# EAGLE schematic Bee_Hive_Mona_parallel_scara_V0.1 (EAGLE 9.7.0)

## Sheet 1 of 2
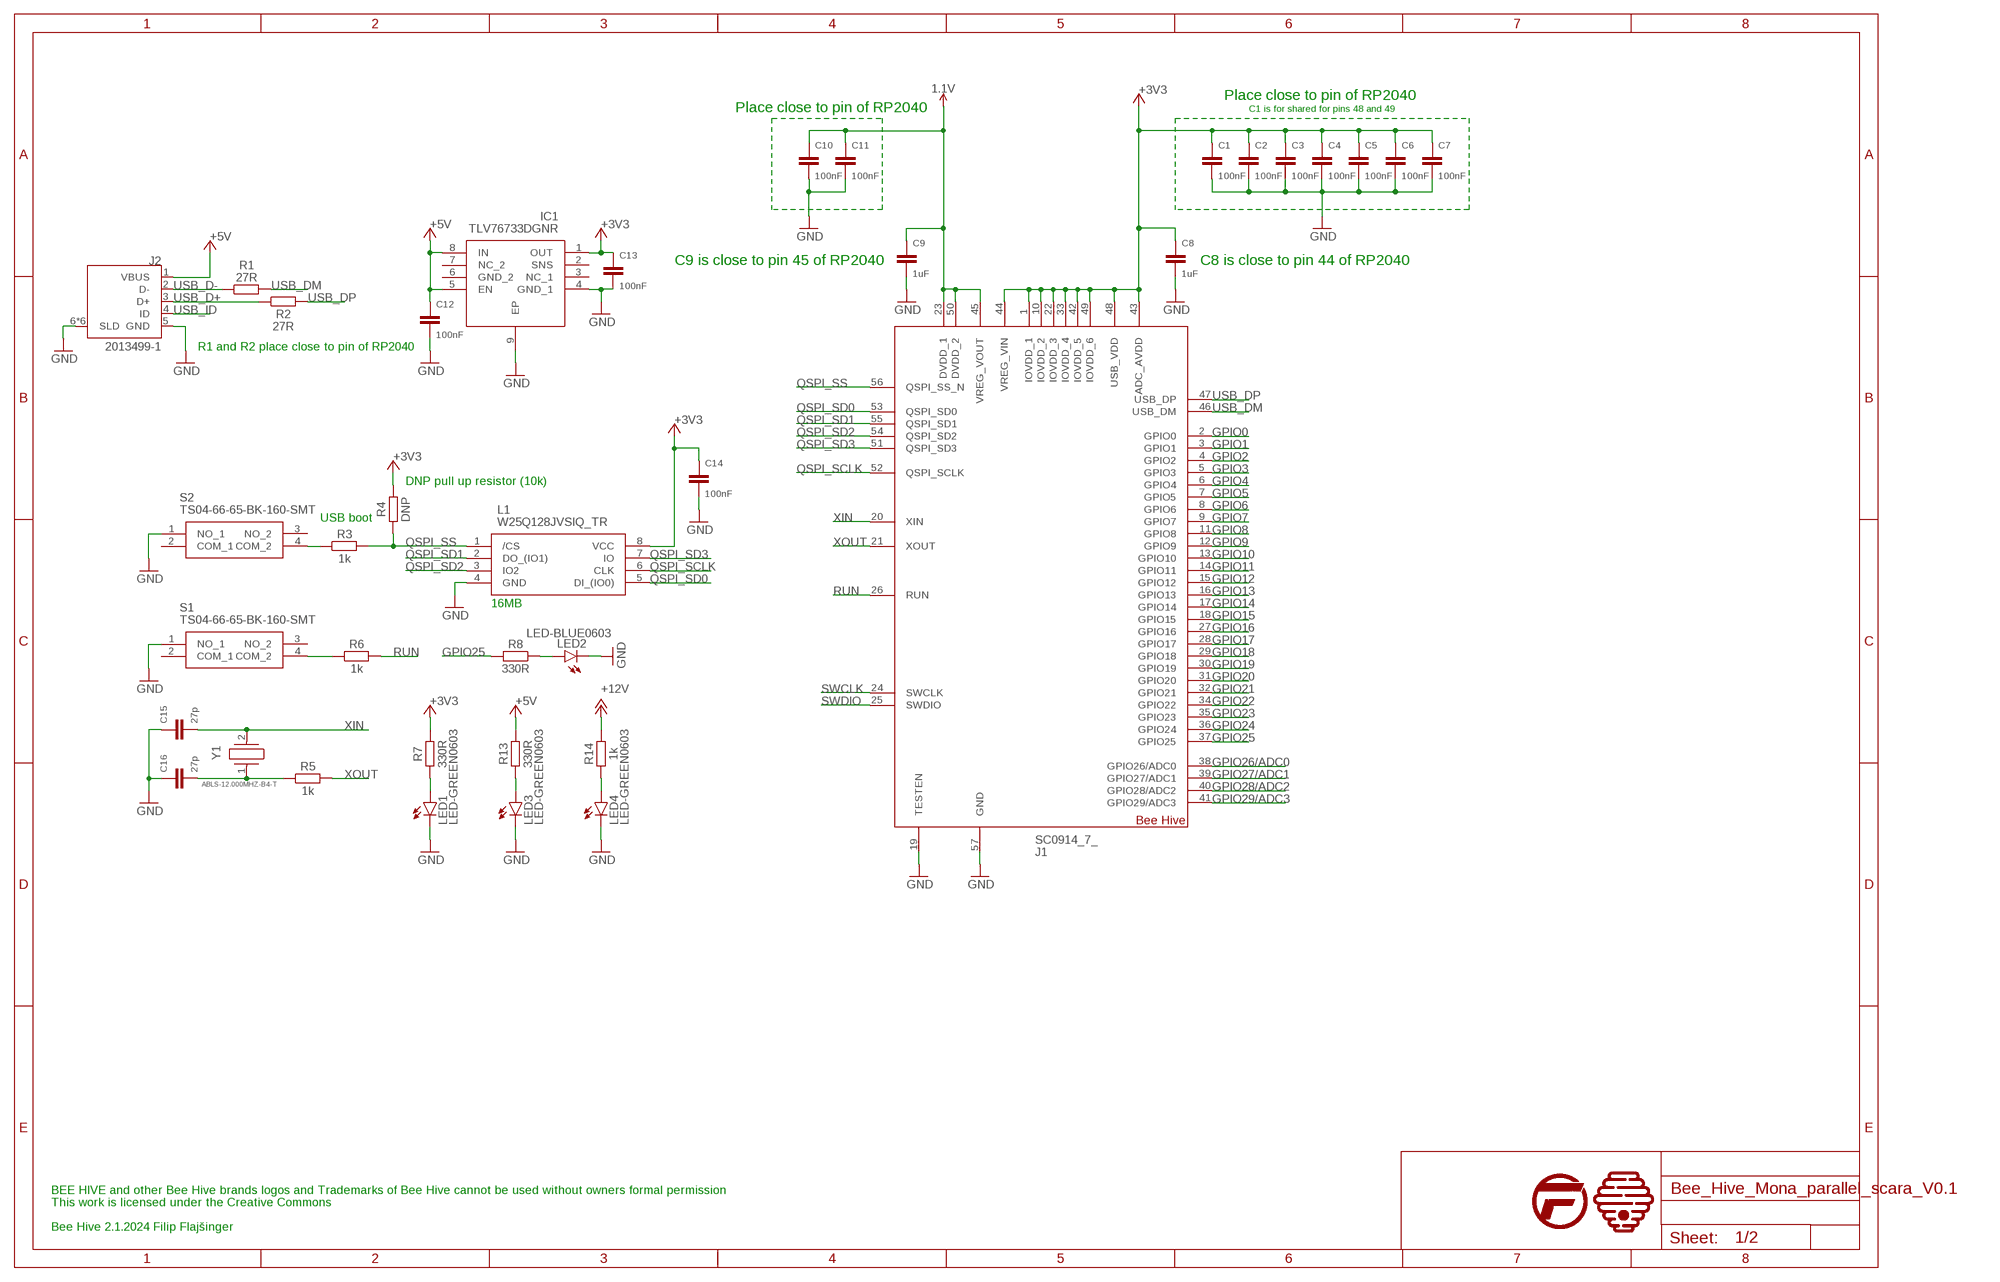
[diagram p0: schematic, sheet 1]

### Parts
C1  100nF  C_CHIP-0603(1608-METRIC)  [CAPC1608X85]
C2  100nF  C_CHIP-0603(1608-METRIC)  [CAPC1608X85]
C3  100nF  C_CHIP-0603(1608-METRIC)  [CAPC1608X85]
C4  100nF  C_CHIP-0603(1608-METRIC)  [CAPC1608X85]
C5  100nF  C_CHIP-0603(1608-METRIC)  [CAPC1608X85]
C6  100nF  C_CHIP-0603(1608-METRIC)  [CAPC1608X85]
C7  100nF  C_CHIP-0603(1608-METRIC)  [CAPC1608X85]
C8  1uF  C_CHIP-0603(1608-METRIC)  [CAPC1608X85]
C9  1uF  C_CHIP-0603(1608-METRIC)  [CAPC1608X85]
C10  100nF  C_CHIP-0603(1608-METRIC)  [CAPC1608X85]
C11  100nF  C_CHIP-0603(1608-METRIC)  [CAPC1608X85]
C12  100nF  C_CHIP-0603(1608-METRIC)  [CAPC1608X85]
C13  100nF  C_CHIP-0603(1608-METRIC)  [CAPC1608X85]
C14  100nF  C_CHIP-0603(1608-METRIC)  [CAPC1608X85]
C15  27p  C_CHIP-0603(1608-METRIC)  [CAPC1608X85]
C16  27p  C_CHIP-0603(1608-METRIC)  [CAPC1608X85]
IC1  TLV76733DGNR  [SOP65P490X110-9N]
J1  SC0914_7_  [QFN40P700X700X90-57N]
J2  2013499-1  [TE_2013499-1]
L1  W25Q128JVSIQ_TR  [SOIC127P780X195-8N]
LED1  LED-GREEN0603  [0603-GREEN]
LED2  LED-BLUE0603  [0603-BLUE]
LED3  LED-GREEN0603  [0603-GREEN]
LED4  LED-GREEN0603  [0603-GREEN]
R1  27R  R_CHIP-0603(1608-METRIC)  [RESC1608X60]
R2  27R  R_CHIP-0603(1608-METRIC)  [RESC1608X60]
R3  1k  R_CHIP-0603(1608-METRIC)  [RESC1608X60]
R4  DNP  R_CHIP-0603(1608-METRIC)  [RESC1608X60]
R5  1k  R_CHIP-0603(1608-METRIC)  [RESC1608X60]
R6  1k  R_CHIP-0603(1608-METRIC)  [RESC1608X60]
R7  330R  R_CHIP-0603(1608-METRIC)  [RESC1608X60]
R8  330R  R_CHIP-0603(1608-METRIC)  [RESC1608X60]
R13  330R  R_CHIP-0603(1608-METRIC)  [RESC1608X60]
R14  1k  R_CHIP-0603(1608-METRIC)  [RESC1608X60]
S1  TS04-66-65-BK-160-SMT  [TS046665BK160SMT]
S2  TS04-66-65-BK-160-SMT  [TS046665BK160SMT]
Y1  ABLS-12.000MHZ-B4-T  [ABLS]

### Nets
1.1V: C9.1 C10.1 C11.1 J1.23(DVDD_1) J1.45(VREG_VOUT) J1.50(DVDD_2)
+3V3: C1.1 C2.1 C3.1 C4.1 C5.1 C6.1 C7.1 C8.1 C13.1 C14.1 IC1.1(OUT) J1.1(IOVDD_1) J1.10(IOVDD_2) J1.22(IOVDD_3) J1.33(IOVDD_4) J1.42(IOVDD_5) J1.43(ADC_AVDD) J1.44(VREG_VIN) J1.48(USB_VDD) J1.49(IOVDD_6) L1.8(VCC) R4.2 R7.2 ; also sheet 2
+5V: C12.1 IC1.5(EN) IC1.8(IN) J2.1(VBUS) R13.2 ; also sheet 2
+12V: R14.2 ; also sheet 2
GND: C1.2 C2.2 C3.2 C4.2 C5.2 C6.2 C7.2 C8.2 C9.2 C10.2 C11.2 C12.2 C13.2 C14.2 C15.1 C16.1 IC1.4(GND_1) IC1.9(EP) J1.19(TESTEN) J1.57(GND) J2.5(GND) J2.6(SLD) J2.7(SLD) J2.8(SLD) J2.9(SLD) J2.10(SLD) J2.11(SLD) L1.4(GND) LED1.C LED2.C LED3.C LED4.C S1.1(NO_1) S2.1(NO_1) ; also sheet 2
GPIO0: J1.2(GPIO0) ; also sheet 2
GPIO1: J1.3(GPIO1) ; also sheet 2
GPIO2: J1.4(GPIO2) ; also sheet 2
GPIO3: J1.5(GPIO3) ; also sheet 2
GPIO4: J1.6(GPIO4) ; also sheet 2
GPIO5: J1.7(GPIO5) ; also sheet 2
GPIO6: J1.8(GPIO6) ; also sheet 2
GPIO7: J1.9(GPIO7) ; also sheet 2
GPIO8: J1.11(GPIO8) ; also sheet 2
GPIO9: J1.12(GPIO9) ; also sheet 2
GPIO10: J1.13(GPIO10) ; also sheet 2
GPIO11: J1.14(GPIO11) ; also sheet 2
GPIO12: J1.15(GPIO12) ; also sheet 2
GPIO13: J1.16(GPIO13) ; also sheet 2
GPIO14: J1.17(GPIO14) ; also sheet 2
GPIO15: J1.18(GPIO15) ; also sheet 2
GPIO16: J1.27(GPIO16) ; also sheet 2
GPIO17: J1.28(GPIO17) ; also sheet 2
GPIO18: J1.29(GPIO18) ; also sheet 2
GPIO19: J1.30(GPIO19) ; also sheet 2
GPIO20: J1.31(GPIO20) ; also sheet 2
GPIO21: J1.32(GPIO21) ; also sheet 2
GPIO22: J1.34(GPIO22) ; also sheet 2
GPIO23: J1.35(GPIO23) ; also sheet 2
GPIO24: J1.36(GPIO24) ; also sheet 2
GPIO25: J1.37(GPIO25) R8.2 ; also sheet 2
GPIO26/ADC0: J1.38(GPIO26/ADC0) ; also sheet 2
GPIO27/ADC1: J1.39(GPIO27/ADC1) ; also sheet 2
GPIO28/ADC2: J1.40(GPIO28/ADC2) ; also sheet 2
GPIO29/ADC3: J1.41(GPIO29/ADC3) ; also sheet 2
N$4: R3.1 S2.4(COM_2)
N$5: R6.1 S1.4(COM_2)
N$6: C16.2 R5.1 Y1.1
N$8: LED2.A R8.1
N$40: LED1.A R7.1
N$48: LED3.A R13.1
N$49: LED4.A R14.1
QSPI_SCLK: J1.52(QSPI_SCLK) L1.6(CLK)
QSPI_SD0: J1.53(QSPI_SD0) L1.5(DI_(IO0))
QSPI_SD1: J1.55(QSPI_SD1) L1.2(DO_(IO1))
QSPI_SD2: J1.54(QSPI_SD2) L1.3(IO2)
QSPI_SD3: J1.51(QSPI_SD3) L1.7(IO)
QSPI_SS: J1.56(QSPI_SS_N) L1.1(/CS) R3.2 R4.1
RUN: J1.26(RUN) R6.2
SWCLK: J1.24(SWCLK)
SWDIO: J1.25(SWDIO)
USB_D+: J2.3(D+) R2.1
USB_D-: J2.2(D-) R1.1
USB_DM: J1.46(USB_DM) R1.2
USB_DP: J1.47(USB_DP) R2.2
USB_ID: J2.4(ID)
XIN: C15.2 J1.20(XIN) Y1.2
XOUT: J1.21(XOUT) R5.2
Unconnected: IC1.2(SNS) IC1.3(NC_1) IC1.6(GND_2) IC1.7(NC_2) S1.2(COM_1) S1.3(NO_2) S2.2(COM_1) S2.3(NO_2)

### Notes on the sheet
- Place close to pin of RP2040
- Place close to pin of RP2040 | C1 is for shared for pins 48 and 49
- C9 is close to pin 45 of RP2040 | C8 is close to pin 44 of RP2040
- R1 and R2 place close to pin of RP2040
- DNP pull up resistor (10k)
- USB boot
- 16MB
- BEE HIVE and other Bee Hive brands logos and Trademarks of Bee Hive cannot be used without owners formal permission
- This work is licensed under the Creative Commons
- Bee Hive 2.1.2024 Filip Flajšinger

## Sheet 2 of 2
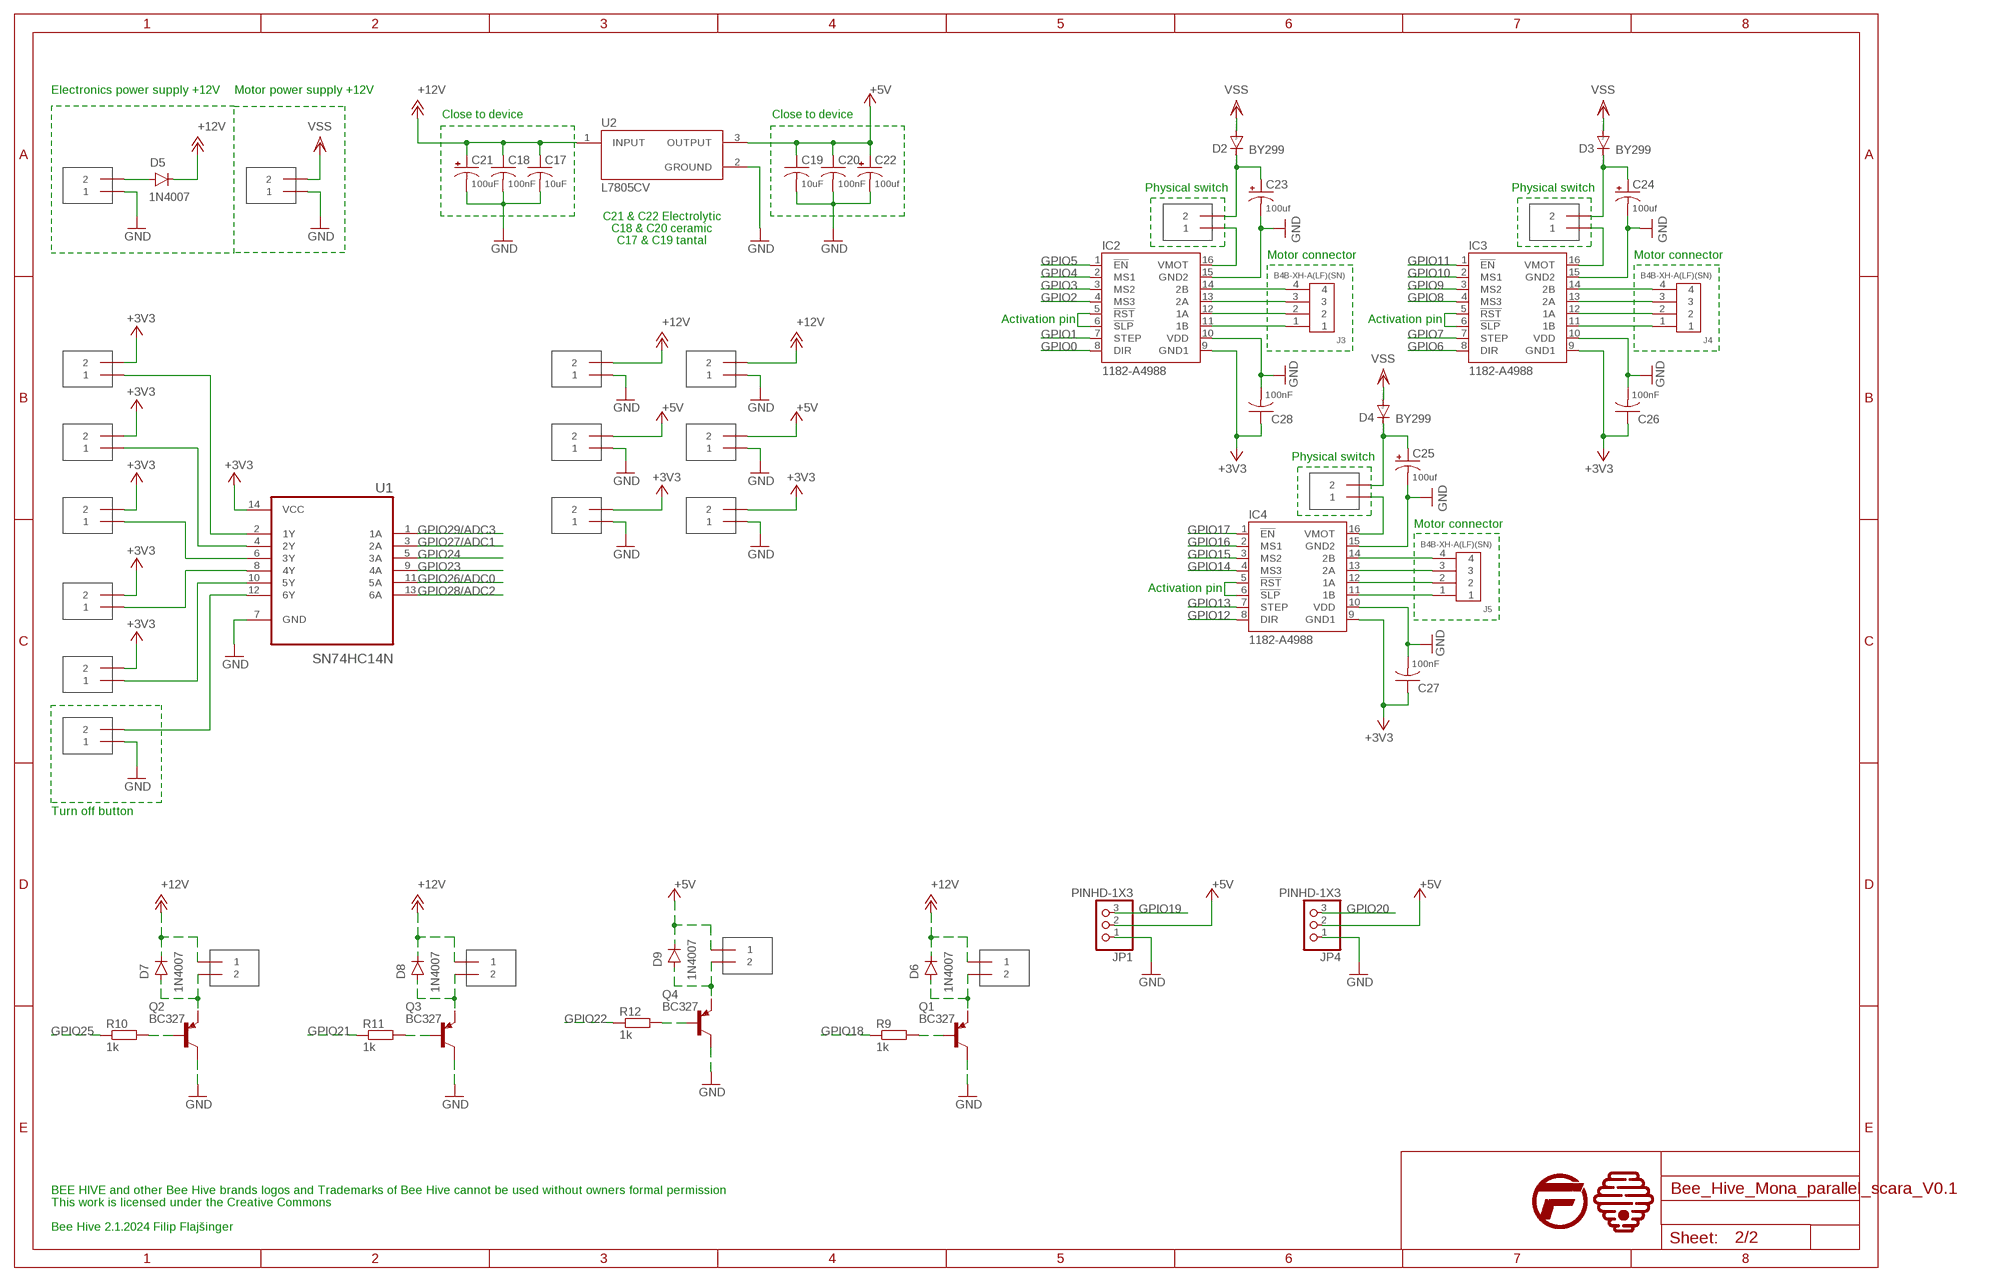
[diagram p1: schematic, sheet 2]

### Parts
C17  10uF  C-US025-024X044  [C025-024X044]
C18  100nF  C-US025-024X044  [C025-024X044]
C19  10uF  C-US025-024X044  [C025-024X044]
C20  100nF  C-US025-024X044  [C025-024X044]
C21  100uF  CPOL-USE1.8-4  [E1,8-4]
C22  100uf  CPOL-USE1.8-4  [E1,8-4]
C23  100uf  CPOL-USE1.8-4  [E1,8-4]
C24  100uf  CPOL-USE1.8-4  [E1,8-4]
C25  100uf  CPOL-USE1.8-4  [E1,8-4]
C26  100nF  C-US025-024X044  [C025-024X044]
C27  100nF  C-US025-024X044  [C025-024X044]
C28  100nF  C-US025-024X044  [C025-024X044]
D2  BY299  DIODE-DO15-12  [DO15-12]
D3  BY299  DIODE-DO15-12  [DO15-12]
D4  BY299  DIODE-DO15-12  [DO15-12]
D5  1N4007  [DO-41]
D6  1N4007  [DO-41]
D7  1N4007  [DO-41]
D8  1N4007  [DO-41]
D9  1N4007  [DO-41]
IC2  1182-A4988  [A4988]
IC3  1182-A4988  [A4988]
IC4  1182-A4988  [A4988]
J3  B4B-XH-A(LF)(SN)  [B4B-XH-A(LF)(SN)]
J4  B4B-XH-A(LF)(SN)  [B4B-XH-A(LF)(SN)]
J5  B4B-XH-A(LF)(SN)  [B4B-XH-A(LF)(SN)]
JP1  PINHD-1X3  [1X03]
JP4  PINHD-1X3  [1X03]
Q1  BC327  [TO92]
Q2  BC327  [TO92]
Q3  BC327  [TO92]
Q4  BC327  [TO92]
R9  1k  R-EU_0204/7  [0204/7]
R10  1k  R-EU_0204/7  [0204/7]
R11  1k  R-EU_0204/7  [0204/7]
R12  1k  R-EU_0204/7  [0204/7]
U1  SN74HC14N  [DIP794W45P254L1969H508Q14]
U2  L7805CV  [TO255P1040X460X1968-3]
U$1  TERMINAL_2P  [KF301-2P]
U$2  TERMINAL_2P  [KF301-2P]
U$3  TERMINAL_2P  [KF301-2P]
U$4  TERMINAL_2P  [KF301-2P]
U$5  TERMINAL_2P  [KF301-2P]
U$6  TERMINAL_2P  [KF301-2P]
U$7  TERMINAL_2P  [KF301-2P]
U$8  TERMINAL_2P  [KF301-2P]
U$9  TERMINAL_2P  [KF301-2P]
U$10  TERMINAL_2P  [KF301-2P]
U$11  TERMINAL_2P  [KF301-2P]
U$12  TERMINAL_2P  [KF301-2P]
U$15  TERMINAL_2P  [KF301-2P]
U$16  TERMINAL_2P  [KF301-2P]
U$17  TERMINAL_2P  [KF301-2P]
U$18  TERMINAL_2P  [KF301-2P]
U$19  TERMINAL_2P  [KF301-2P]
U$20  TERMINAL_2P  [KF301-2P]
U$21  TERMINAL_2P  [KF301-2P]
U$22  TERMINAL_2P  [KF301-2P]
U$23  TERMINAL_2P  [KF301-2P]

### Nets
+3V3: C26.1 C27.1 C28.1 IC2.9(GND1) IC3.9(GND1) IC4.9(GND1) U1.14(VCC) U$12.2 U$17.2 U$18.2 U$19.2 U$20.2 U$21.2 U$23.2 ; also sheet 1
+5V: C19.1 C20.1 C22.+ D9.C JP1.2 JP4.2 U2.3(OUTPUT) U$9.1 U$11.2 U$16.2 ; also sheet 1
+12V: C17.1 C18.1 C21.+ D5.C D6.C D7.C D8.C U2.1(INPUT) U$6.1 U$7.1 U$8.1 U$10.2 U$15.2 ; also sheet 1
GND: C17.2 C18.2 C19.2 C20.2 C21.- C22.- C23.- C24.- C25.- C26.2 C27.2 C28.2 IC2.10(VDD) IC2.15(GND2) IC3.10(VDD) IC3.15(GND2) IC4.10(VDD) IC4.15(GND2) JP1.1 JP4.1 Q1.3(C) Q2.3(C) Q3.3(C) Q4.3(C) U1.7(GND) U2.2(GROUND) U$4.1 U$5.1 U$10.1 U$11.1 U$12.1 U$15.1 U$16.1 U$17.1 U$22.1 ; also sheet 1
GPIO0: IC2.8(DIR) ; also sheet 1
GPIO1: IC2.7(STEP) ; also sheet 1
GPIO2: IC2.4(MS3) ; also sheet 1
GPIO3: IC2.3(MS2) ; also sheet 1
GPIO4: IC2.2(MS1) ; also sheet 1
GPIO5: IC2.1(!EN) ; also sheet 1
GPIO6: IC3.8(DIR) ; also sheet 1
GPIO7: IC3.7(STEP) ; also sheet 1
GPIO8: IC3.4(MS3) ; also sheet 1
GPIO9: IC3.3(MS2) ; also sheet 1
GPIO10: IC3.2(MS1) ; also sheet 1
GPIO11: IC3.1(!EN) ; also sheet 1
GPIO12: IC4.8(DIR) ; also sheet 1
GPIO13: IC4.7(STEP) ; also sheet 1
GPIO14: IC4.4(MS3) ; also sheet 1
GPIO15: IC4.3(MS2) ; also sheet 1
GPIO16: IC4.2(MS1) ; also sheet 1
GPIO17: IC4.1(!EN) ; also sheet 1
GPIO18: R9.1 ; also sheet 1
GPIO19: JP1.3 ; also sheet 1
GPIO20: JP4.3 ; also sheet 1
GPIO21: R11.1 ; also sheet 1
GPIO22: R12.1 ; also sheet 1
GPIO23: U1.9(4A) ; also sheet 1
GPIO24: U1.5(3A) ; also sheet 1
GPIO25: R10.1 ; also sheet 1
GPIO26/ADC0: U1.11(5A) ; also sheet 1
GPIO27/ADC1: U1.3(2A) ; also sheet 1
GPIO28/ADC2: U1.13(6A) ; also sheet 1
GPIO29/ADC3: U1.1(1A) ; also sheet 1
N$3: D5.A U$4.2
N$10: IC2.11(1B) J3.1
N$11: IC2.12(1A) J3.2
N$12: IC2.13(2A) J3.3
N$13: IC2.14(2B) J3.4
N$14: IC2.5(!RST) IC2.6(!SLP)
N$16: IC2.16(VMOT) U$1.1
N$17: IC3.16(VMOT) U$2.1
N$18: IC4.16(VMOT) U$3.1
N$22: IC3.11(1B) J4.1
N$23: IC3.12(1A) J4.2
N$24: IC3.13(2A) J4.3
N$25: IC3.14(2B) J4.4
N$26: IC3.5(!RST) IC3.6(!SLP)
N$30: C23.+ D2.C U$1.2
N$31: C24.+ D3.C U$2.2
N$32: C25.+ D4.C U$3.2
N$33: IC4.11(1B) J5.1
N$34: IC4.12(1A) J5.2
N$35: IC4.13(2A) J5.3
N$36: IC4.14(2B) J5.4
N$37: IC4.5(!RST) IC4.6(!SLP)
N$39: D6.A Q1.1(E) U$6.2
N$41: Q1.2(B) R9.2
N$42: D7.A Q2.1(E) U$7.2
N$43: Q2.2(B) R10.2
N$44: D8.A Q3.1(E) U$8.2
N$45: Q3.2(B) R11.2
N$46: D9.A Q4.1(E) U$9.2
N$47: Q4.2(B) R12.2
N$50: U1.8(4Y) U$21.1
N$52: U1.6(3Y) U$19.1
N$53: U1.4(2Y) U$18.1
N$54: U1.2(1Y) U$23.1
N$55: U1.10(5Y) U$20.1
N$56: U1.12(6Y) U$22.2
VSS: D2.A D3.A D4.A U$5.2

### Notes on the sheet
- Electronics power supply +12V | Motor power supply +12V
- Close to device | Close to device
- Physical switch | Physical switch
- C21 & C22 Electrolytic
  C18 & C20 ceramic
  C17 & C19 tantal
- Motor connector | Motor connector
- Activation pin | Activation pin
- Physical switch
- Motor connector
- Activation pin
- Turn off button
- BEE HIVE and other Bee Hive brands logos and Trademarks of Bee Hive cannot be used without owners formal permission
- This work is licensed under the Creative Commons
- Bee Hive 2.1.2024 Filip Flajšinger

## Library data of the parts
C1-C16 = Capacitor:C: Capacitor - Generic; CATEGORY: Capacitor
C17-C20 C26-C28 = adafruit:C-US: CAPACITOR, American symbol
C21-C25 = adafruit:CPOL-US: POLARIZED CAPACITOR, American symbol
D2-D4 = diode:DIODE-: DIODE
D5-D9 = Diodes:1N4007: DIODE GEN PURP 1KV 1A DO41 Manufacturer's datasheet <https://www.mccsemi.com/pdf/Products/1N4001-1N4007(DO-41).pdf>; CREATED_BY: PCBLayout.com; DIGIKEY_PART_NUMBER: 1N4007MSCT-ND; MANUFACTURER: Micro Commercial Co; MPN: 1N4007; PACKAGE: DO-41
IC1 = TLV76733DGNR:TLV76733DGNR: LDO Voltage Regulators 1-A, 16-V, high-PSRR, high-accuracy, low-dropout voltage regulator with enable Source: Datasheet <https://www.ti.com/lit/ds/symlink/tlv767.pdf?ts=1601893180135&ref_url=https%3A%2F%2Fduckduckgo.com%2F>; DESCRIPTION: LDO Voltage Regulators 1-A, 16-V, high-PSRR, high-accuracy, low-dropout voltage regulator with enable; HEIGHT: 1.1mm; MANUFACTURER_NAME: Texas Instruments; MANUFACTURER_PART_NUMBER: TLV76733DGNR; MOUSER_PART_NUMBER: 595-TLV76733DGNR; MOUSER_PRICE-STOCK: https://www.mouser.co.uk/ProductDetail/Texas-Instruments/TLV76733DGNR?qs=W%2FMpXkg%252BdQ7WCurh%2FfEdlw%3D%3D
IC2-IC4 = pololu-stepper-driver:1182-A4988: A4988 Stepper Motor Driver Carrier #1182 A4988 Stepper Motor Driver Carrier <https://www.pololu.com/product/1182> in Japan, Suzaku Lab. Ltd. <https://suzakugiken.jp/> #1182 A4988ステッピングモータドライバ <https://szc.jp/po1182>
J1 = SC0914_7_:SC0914_7_: Microcontrollers connect the world of software to the world of hardware. They allow developers to write software which interacts with the physical world in the same deterministic, cycle-accurate manner as digital logic. They occupy the bottom left corner of the price/performance space, outselling their more powerful brethren by a factor of ten to one. They are the workhorses that power the digital transformation of our world. Source: Datasheet; DESCRIPTION: Microcontrollers connect the world of software to the world of hardware. They allow developers to write software which interacts with the physical world in the same deterministic, cycle-accurate manner as digital logic. They occupy the bottom left corner of the price/performance space, outselling their more powerful brethren by a factor of ten to one. They are the workhorses that power the digital transformation of our world.; HEIGHT: 0.9mm; MANUFACTURER_NAME: RASPBERRY-PI; MANUFACTURER_PART_NUMBER: SC0914(7); MOUSER_PART_NUMBER: 358-SC09147; MOUSER_PRICE-STOCK: https://www.mouser.co.uk/ProductDetail/Raspberry-Pi/SC09147?qs=T%252BzbugeAwjhSpdbCB4ve%252Bg%3D%3D
J2 = 2013499-1:2013499-1: CONN PCB USB 5POS Check availability <https://pricing.snapeda.com/parts/2013499-1/TE%20Connectivity/view-part?ref=eda>; AVAILABILITY: In Stock; CENTERLINE_PITCH: .65 mm[.025 in]; COMMENT: 2013499-1; DESCRIPTION: USB - micro B USB 2.0 Receptacle Connector 5 Position Surface Mount, Right Angle; Through Hole; MF: TE Connectivity; MP: 2013499-1; NUMBER_OF_POSITIONS: 5; PACKAGE: None; PRICE: None; PRODUCT_TYPE: Connector; PURCHASE-URL: https://pricing.snapeda.com/search?q=2013499-1&ref=eda
J3-J5 = Headers:B4B-XH-A(LF)(SN): CONN HEADER VERT 4POS 2.5MM Manufacturer's datasheet <http://www.jst-mfg.com/product/pdf/eng/eXH.pdf>; CREATED_BY: PCBLayout.com; DIGIKEY_PARTNO: 455-2249-ND; MANUFACTURER: JST Sales America Inc.; MPN: B4B-XH-A(LF)(SN)
JP1 JP4 = Connector:PINHD-1X3: PIN HEADER; CATEGORY: Headers; DESCRIPTION: Header, Straight, 3 Position; MANUFACTURER: Generic; MPN: Generic; OPERATING_TEMPERATURE: Generic; PART_STATUS: Active; PITCH: 0.100" (2.54mm); ROHS_COMPLIANCE: Generic; SERIES: Generic; SUB-CATEGORY: Headers, Male Pins; TYPE: Board to Board or Cable, Unshrouded, Through Hole, Straight
L1 = W25Q128JVSIQ_TR:W25Q128JVSIQ_TR: FLASH - NOR Memory IC 128Mb (16M x 8) SPI - Quad I/O 8-SOIC Source: Datasheet <http://www.winbond.com/resource-files/w25q128jv spi revc 11162016.pdf>; DESCRIPTION: FLASH - NOR Memory IC 128Mb (16M x 8) SPI - Quad I/O 8-SOIC; HEIGHT: 1.95mm; MANUFACTURER_NAME: Winbond; MANUFACTURER_PART_NUMBER: W25Q128JVSIQ TR; MOUSER_PART_NUMBER: 454-W25Q128JVSIQTR; MOUSER_PRICE-STOCK: https://www.mouser.co.uk/ProductDetail/Winbond/W25Q128JVSIQ-TR?qs=qSfuJ%252Bfl%2Fd7vTyLA9kNdGw%3D%3D
LED1 LED3 LED4 = BeagleBone_Blue_R3:LED-GREEN
LED2 = BeagleBone_Blue_R3:LED-BLUE
Q1-Q4 = transistor-pnp:BC327: PNP Transistor
R1-R8 R13 R14 = Resistor:R: Resistor Fixed - Generic; CATEGORY: Resistor; SUB-CATEGORY: Fixed
R9-R12 = rcl:R-EU_: RESISTOR, European symbol; SPICEPREFIX: R
S1 S2 = TS04-66-65-BK-160-SMT:TS04-66-65-BK-160-SMT: Tactile Switches 6 x 6 mm, 6.5 mm Act Height, 160 gf, Black, Surface Mount, SPST, Source: Datasheet <https://www.cuidevices.com/product/resource/ts04.pdf>; DESCRIPTION: Tactile Switches 6 x 6 mm, 6.5 mm Act Height, 160 gf, Black, Surface Mount, SPST,; HEIGHT: 6.7mm; MANUFACTURER_NAME: CUI Devices; MANUFACTURER_PART_NUMBER: TS04-66-65-BK-160-SMT; MOUSER_PART_NUMBER: 179-TS046665BK160SMT; MOUSER_PRICE-STOCK: https://www.mouser.co.uk/ProductDetail/CUI-Devices/TS04-66-65-BK-160-SMT?qs=A6eO%252BMLsxmTgRLoTHWtDYQ%3D%3D
U1 = SN74HC14N:SN74HC14N: Check availability <https://pricing.snapeda.com/parts/SN74HC14N/Texas%20Instruments/view-part?ref=eda>; AVAILABILITY: In Stock; DESCRIPTION: 6-ch, 2-V to 6-V inverters with Schmitt-Trigger inputs; MF: Texas Instruments; MP: SN74HC14N; PACKAGE: PDIP-14 Texas Instruments; PRICE: None; PURCHASE-URL: https://pricing.snapeda.com/search/part/SN74HC14N/?ref=eda
U2 = L7805CV:L7805CV: Standard Regulator Pos 5V 1.5A 3-Pin(3+Tab) TO-220 Standard Regulator Pos 5V 1.5A 3-Pin(3+Tab) TO-220 Check availability <https://pricing.snapeda.com/parts/L7805CV/STMicroelectronics/view-part?ref=eda>; AVAILABILITY: In Stock; DESCRIPTION: Linear Voltage Regulator IC Positive Fixed 1 Output 1.5A TO-220; MF: STMicroelectronics; MP: L7805CV; PACKAGE: TO-220-3 STMicroelectronics; PRICE: None; PURCHASE-URL: https://pricing.snapeda.com/search/part/L7805CV/?ref=eda
U$1-U$12 U$15-U$23 = KF301-2P-Terminal:TERMINAL_2P: Terminal Screw 2 Port 5mm Pitch
Y1 = ABLS-12.000MHZ-B4-T:ABLS-12.000MHZ-B4-T: ABRACON - ABLS-12.000MHZ-B4-T - CRYSTAL, 12MHZ, 18PF, HC-49US Source: Datasheet <https://abracon.com/Resonators/abls.pdf>